# Altium project NIXIE_Display.PrjPcb
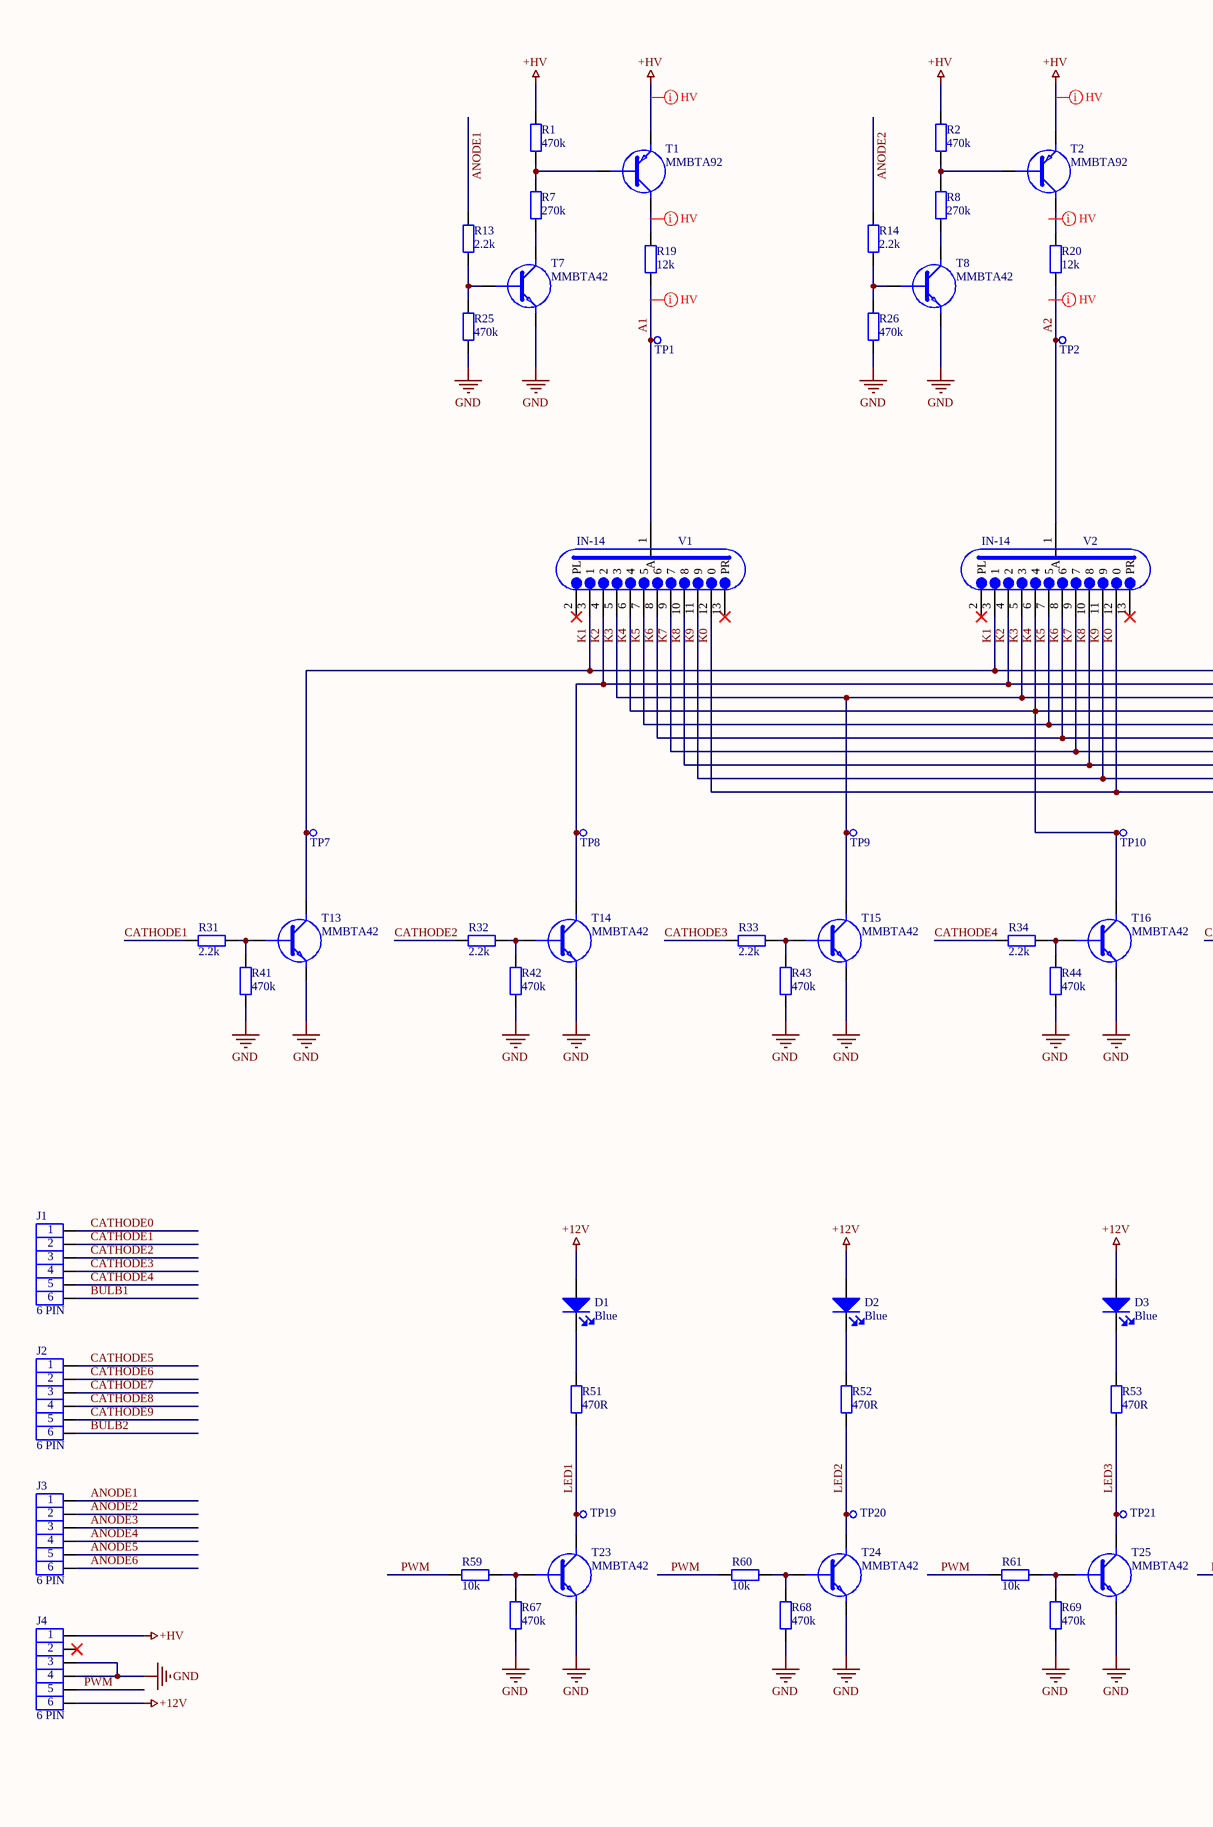
[diagram p0: NIXIE_Display.SchDoc, left]
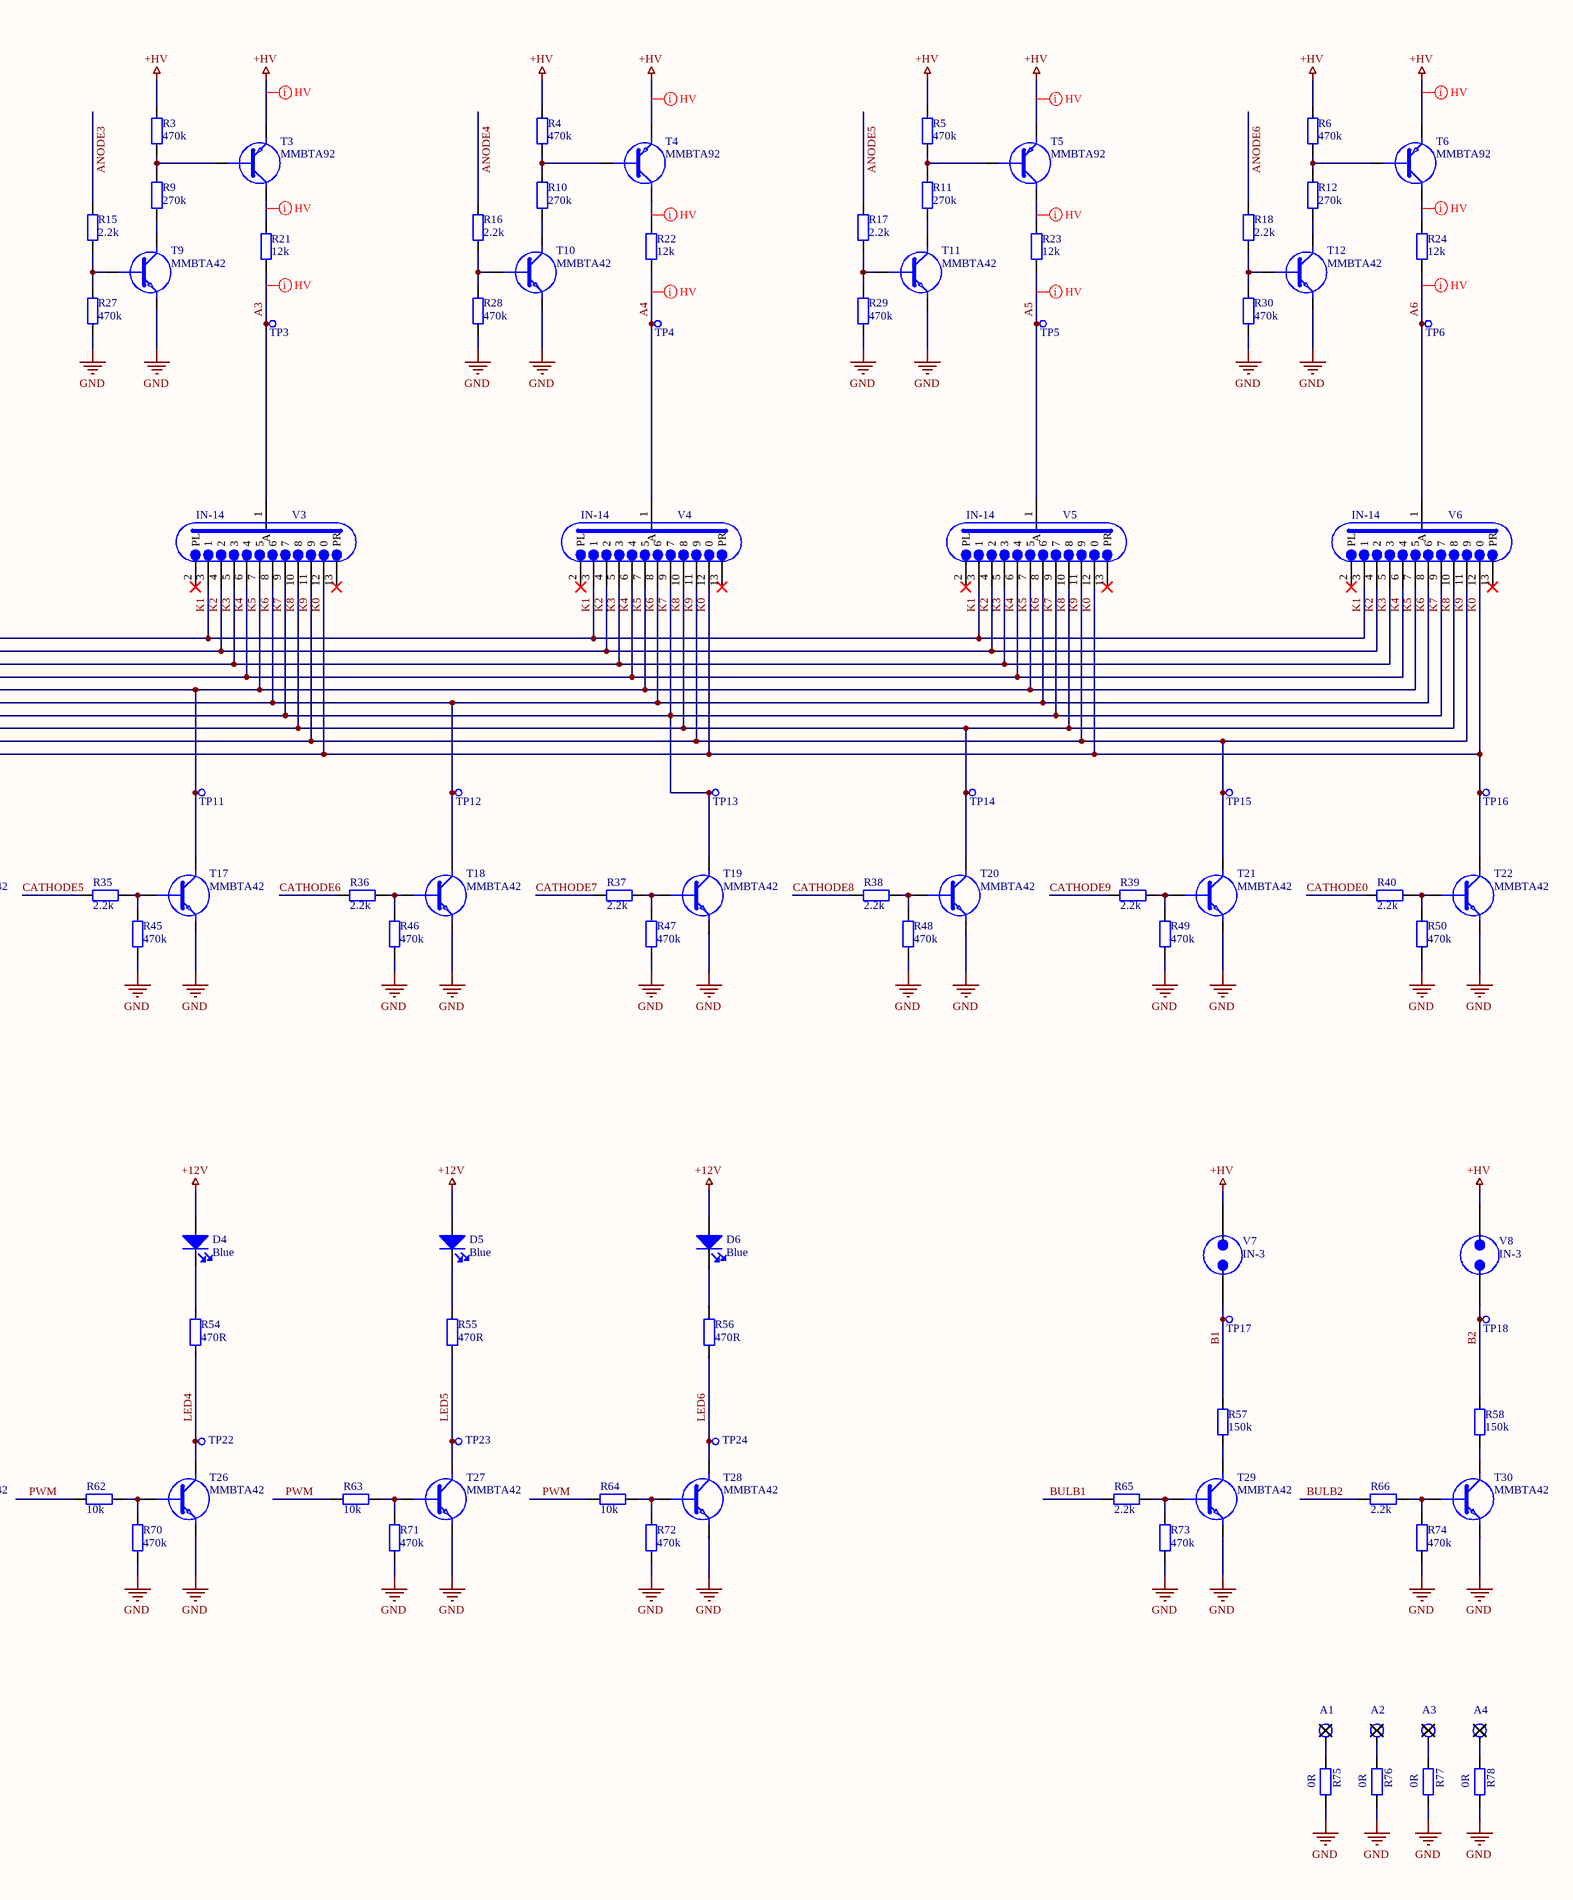
[diagram p1: NIXIE_Display.SchDoc, right]
1 sheet, 154 parts. Net scope: global (net labels, ports and power ports of the same name join across sheets).
Board file: NIXIE_Display.PcbDoc

## Sheet NIXIE_Display.SchDoc
size A2; SheetNumber: 1; SheetTotal: 1

### Parts
A1  3mm  [HOLE M3]  (value not drawn)
A2  3mm  [HOLE M3]  (value not drawn)
A3  3mm  [HOLE M3]  (value not drawn)
A4  3mm  [HOLE M3]  (value not drawn)
D1  Blue  [LED 0805]
D2  Blue  [LED 0805]
D3  Blue  [LED 0805]
D4  Blue  [LED 0805]
D5  Blue  [LED 0805]
D6  Blue  [LED 0805]
J1  6 PIN  [MECHANICAL PINHEADER 6P 2.54MM MALE]
J2  6 PIN  [MECHANICAL PINHEADER 6P 2.54MM MALE]
J3  6 PIN  [MECHANICAL PINHEADER 6P 2.54MM MALE]
J4  6 PIN  [MECHANICAL PINHEADER 6P 2.54MM MALE]
R1  470k  [RESISTOR 1206]
R2  470k  [RESISTOR 1206]
R3  470k  [RESISTOR 1206]
R4  470k  [RESISTOR 1206]
R5  470k  [RESISTOR 1206]
R6  470k  [RESISTOR 1206]
R7  270k  [RESISTOR 1206]
R8  270k  [RESISTOR 1206]
R9  270k  [RESISTOR 1206]
R10  270k  [RESISTOR 1206]
R11  270k  [RESISTOR 1206]
R12  270k  [RESISTOR 1206]
R13  2.2k  [RESISTOR 0603]
R14  2.2k  [RESISTOR 0603]
R15  2.2k  [RESISTOR 0603]
R16  2.2k  [RESISTOR 0603]
R17  2.2k  [RESISTOR 0603]
R18  2.2k  [RESISTOR 0603]
R19  12k  [RESISTOR 0603]
R20  12k  [RESISTOR 0603]
R21  12k  [RESISTOR 0603]
R22  12k  [RESISTOR 0603]
R23  12k  [RESISTOR 0603]
R24  12k  [RESISTOR 0603]
R25  470k  [RESISTOR 0603]
R26  470k  [RESISTOR 0603]
R27  470k  [RESISTOR 0603]
R28  470k  [RESISTOR 0603]
R29  470k  [RESISTOR 0603]
R30  470k  [RESISTOR 0603]
R31  2.2k  [RESISTOR 0603]
R32  2.2k  [RESISTOR 0603]
R33  2.2k  [RESISTOR 0603]
R34  2.2k  [RESISTOR 0603]
R35  2.2k  [RESISTOR 0603]
R36  2.2k  [RESISTOR 0603]
R37  2.2k  [RESISTOR 0603]
R38  2.2k  [RESISTOR 0603]
R39  2.2k  [RESISTOR 0603]
R40  2.2k  [RESISTOR 0603]
R41  470k  [RESISTOR 0603]
R42  470k  [RESISTOR 0603]
R43  470k  [RESISTOR 0603]
R44  470k  [RESISTOR 0603]
R45  470k  [RESISTOR 0603]
R46  470k  [RESISTOR 0603]
R47  470k  [RESISTOR 0603]
R48  470k  [RESISTOR 0603]
R49  470k  [RESISTOR 0603]
R50  470k  [RESISTOR 0603]
R51  470R  [RESISTOR 0603]
R52  470R  [RESISTOR 0603]
R53  470R  [RESISTOR 0603]
R54  470R  [RESISTOR 0603]
R55  470R  [RESISTOR 0603]
R56  470R  [RESISTOR 0603]
R57  150k  [RESISTOR 0603]
R58  150k  [RESISTOR 0603]
R59  10k  [RESISTOR 0603]
R60  10k  [RESISTOR 0603]
R61  10k  [RESISTOR 0603]
R62  10k  [RESISTOR 0603]
R63  10k  [RESISTOR 0603]
R64  10k  [RESISTOR 0603]
R65  2.2k  [RESISTOR 0603]
R66  2.2k  [RESISTOR 0603]
R67  470k  [RESISTOR 0603]
R68  470k  [RESISTOR 0603]
R69  470k  [RESISTOR 0603]
R70  470k  [RESISTOR 0603]
R71  470k  [RESISTOR 0603]
R72  470k  [RESISTOR 0603]
R73  470k  [RESISTOR 0603]
R74  470k  [RESISTOR 0603]
R75  0R  [RESISTOR 0603]
R76  0R  [RESISTOR 0603]
R77  0R  [RESISTOR 0603]
R78  0R  [RESISTOR 0603]
T1  MMBTA92  [SOT23-3]
T2  MMBTA92  [SOT23-3]
T3  MMBTA92  [SOT23-3]
T4  MMBTA92  [SOT23-3]
T5  MMBTA92  [SOT23-3]
T6  MMBTA92  [SOT23-3]
T7  MMBTA42  [SOT23-3]
T8  MMBTA42  [SOT23-3]
T9  MMBTA42  [SOT23-3]
T10  MMBTA42  [SOT23-3]
T11  MMBTA42  [SOT23-3]
T12  MMBTA42  [SOT23-3]
T13  MMBTA42  [SOT23-3]
T14  MMBTA42  [SOT23-3]
T15  MMBTA42  [SOT23-3]
T16  MMBTA42  [SOT23-3]
T17  MMBTA42  [SOT23-3]
T18  MMBTA42  [SOT23-3]
T19  MMBTA42  [SOT23-3]
T20  MMBTA42  [SOT23-3]
T21  MMBTA42  [SOT23-3]
T22  MMBTA42  [SOT23-3]
T23  MMBTA42  [SOT23-3]
T24  MMBTA42  [SOT23-3]
T25  MMBTA42  [SOT23-3]
T26  MMBTA42  [SOT23-3]
T27  MMBTA42  [SOT23-3]
T28  MMBTA42  [SOT23-3]
T29  MMBTA42  [SOT23-3]
T30  MMBTA42  [SOT23-3]
TP1  1mm  [TEST POINT 1MM]  (value not drawn)
TP2  1mm  [TEST POINT 1MM]  (value not drawn)
TP3  1mm  [TEST POINT 1MM]  (value not drawn)
TP4  1mm  [TEST POINT 1MM]  (value not drawn)
TP5  1mm  [TEST POINT 1MM]  (value not drawn)
TP6  1mm  [TEST POINT 1MM]  (value not drawn)
TP7  1mm  [TEST POINT 1MM]  (value not drawn)
TP8  1mm  [TEST POINT 1MM]  (value not drawn)
TP9  1mm  [TEST POINT 1MM]  (value not drawn)
TP10  1mm  [TEST POINT 1MM]  (value not drawn)
TP11  1mm  [TEST POINT 1MM]  (value not drawn)
TP12  1mm  [TEST POINT 1MM]  (value not drawn)
TP13  1mm  [TEST POINT 1MM]  (value not drawn)
TP14  1mm  [TEST POINT 1MM]  (value not drawn)
TP15  1mm  [TEST POINT 1MM]  (value not drawn)
TP16  1mm  [TEST POINT 1MM]  (value not drawn)
TP17  1mm  [TEST POINT 1MM]  (value not drawn)
TP18  1mm  [TEST POINT 1MM]  (value not drawn)
TP19  1mm  [TEST POINT 1MM]  (value not drawn)
TP20  1mm  [TEST POINT 1MM]  (value not drawn)
TP21  1mm  [TEST POINT 1MM]  (value not drawn)
TP22  1mm  [TEST POINT 1MM]  (value not drawn)
TP23  1mm  [TEST POINT 1MM]  (value not drawn)
TP24  1mm  [TEST POINT 1MM]  (value not drawn)
V1  IN-14  [IN-14]
V2  IN-14  [IN-14]
V3  IN-14  [IN-14]
V4  IN-14  [IN-14]
V5  IN-14  [IN-14]
V6  IN-14  [IN-14]
V7  IN-3  [IN-3]
V8  IN-3  [IN-3]

### Nets
+12V: D1.1 D2.1 D3.1 D4.1 D5.1 D6.1 J4.6
+HV: J4.1 R1.2 R2.2 R3.2 R4.2 R5.2 R6.2 T1.2(E) T2.2(E) T3.2(E) T4.2(E) T5.2(E) T6.2(E) V7.2 V8.2
GND: J4.3 J4.4 R25.1 R26.1 R27.1 R28.1 R29.1 R30.1 R41.1 R42.1 R43.1 R44.1 R45.1 R46.1 R47.1 R48.1 R49.1 R50.1 R67.1 R68.1 R69.1 R70.1 R71.1 R72.1 R73.1 R74.1 R75.1 R76.1 R77.1 R78.1 T7.2(E) T8.2(E) T9.2(E) T10.2(E) T11.2(E) T12.2(E) T13.2(E) T14.2(E) T15.2(E) T16.2(E) T17.2(E) T18.2(E) T19.2(E) T20.2(E) T21.2(E) T22.2(E) T23.2(E) T24.2(E) T25.2(E) T26.2(E) T27.2(E) T28.2(E) T29.2(E) T30.2(E)
A1: R19.1 TP1.1 V1.1(A)
A2: R20.1 TP2.1 V2.1(A)
A3: R21.1 TP3.1 V3.1(A)
A4: R22.1 TP4.1 V4.1(A)
A5: R23.1 TP5.1 V5.1(A)
A6: R24.1 TP6.1 V6.1(A)
ANODE1: J3.1 R13.1
ANODE2: J3.2 R14.1
ANODE3: J3.3 R15.1
ANODE4: J3.4 R16.1
ANODE5: J3.5 R17.1
ANODE6: J3.6 R18.1
B1: R57.2 TP17.1 V7.1
B2: R58.2 TP18.1 V8.1
BULB1: J1.6 R65.1
BULB2: J2.6 R66.1
CATHODE0: J1.1 R40.1
CATHODE1: J1.2 R31.1
CATHODE2: J1.3 R32.1
CATHODE3: J1.4 R33.1
CATHODE4: J1.5 R34.1
CATHODE5: J2.1 R35.1
CATHODE6: J2.2 R36.1
CATHODE7: J2.3 R37.1
CATHODE8: J2.4 R38.1
CATHODE9: J2.5 R39.1
K0: T22.3(C) TP16.1 V1.12(0) V2.12(0) V3.12(0) V4.12(0) V5.12(0) V6.12(0)
K1: T13.3(C) TP7.1 V1.3(1) V2.3(1) V3.3(1) V4.3(1) V5.3(1) V6.3(1)
K2: T14.3(C) TP8.1 V1.4(2) V2.4(2) V3.4(2) V4.4(2) V5.4(2) V6.4(2)
K3: T15.3(C) TP9.1 V1.5(3) V2.5(3) V3.5(3) V4.5(3) V5.5(3) V6.5(3)
K4: T16.3(C) TP10.1 V1.6(4) V2.6(4) V3.6(4) V4.6(4) V5.6(4) V6.6(4)
K5: T17.3(C) TP11.1 V1.7(5) V2.7(5) V3.7(5) V4.7(5) V5.7(5) V6.7(5)
K6: T18.3(C) TP12.1 V1.8(6) V2.8(6) V3.8(6) V4.8(6) V5.8(6) V6.8(6)
K7: T19.3(C) TP13.1 V1.9(7) V2.9(7) V3.9(7) V4.9(7) V5.9(7) V6.9(7)
K8: T20.3(C) TP14.1 V1.10(8) V2.10(8) V3.10(8) V4.10(8) V5.10(8) V6.10(8)
K9: T21.3(C) TP15.1 V1.11(9) V2.11(9) V3.11(9) V4.11(9) V5.11(9) V6.11(9)
LED1: R51.1 T23.3(C) TP19.1
LED2: R52.1 T24.3(C) TP20.1
LED3: R53.1 T25.3(C) TP21.1
LED4: R54.1 T26.3(C) TP22.1
LED5: R55.1 T27.3(C) TP23.1
LED6: R56.1 T28.3(C) TP24.1
PWM: J4.5 R59.1 R60.1 R61.1 R62.1 R63.1 R64.1
NetA1_1: A1.1 R75.2
NetA2_1: A2.1 R76.2
NetA3_1: A3.1 R77.2
NetA4_1: A4.1 R78.2
NetD1_2: D1.2 R51.2
NetD2_2: D2.2 R52.2
NetD3_2: D3.2 R53.2
NetD4_2: D4.2 R54.2
NetD5_2: D5.2 R55.2
NetD6_2: D6.2 R56.2
NetR1_1: R1.1 R7.2 T1.1(B)
NetR2_1: R2.1 R8.2 T2.1(B)
NetR3_1: R3.1 R9.2 T3.1(B)
NetR4_1: R4.1 R10.2 T4.1(B)
NetR5_1: R5.1 R11.2 T5.1(B)
NetR6_1: R6.1 R12.2 T6.1(B)
NetR7_1: R7.1 T7.3(C)
NetR8_1: R8.1 T8.3(C)
NetR9_1: R9.1 T9.3(C)
NetR10_1: R10.1 T10.3(C)
NetR11_1: R11.1 T11.3(C)
NetR12_1: R12.1 T12.3(C)
NetR13_2: R13.2 R25.2 T7.1(B)
NetR14_2: R14.2 R26.2 T8.1(B)
NetR15_2: R15.2 R27.2 T9.1(B)
NetR16_2: R16.2 R28.2 T10.1(B)
NetR17_2: R17.2 R29.2 T11.1(B)
NetR18_2: R18.2 R30.2 T12.1(B)
NetR19_2: R19.2 T1.3(C)
NetR20_2: R20.2 T2.3(C)
NetR21_2: R21.2 T3.3(C)
NetR22_2: R22.2 T4.3(C)
NetR23_2: R23.2 T5.3(C)
NetR24_2: R24.2 T6.3(C)
NetR31_2: R31.2 R41.2 T13.1(B)
NetR32_2: R32.2 R42.2 T14.1(B)
NetR33_2: R33.2 R43.2 T15.1(B)
NetR34_2: R34.2 R44.2 T16.1(B)
NetR35_2: R35.2 R45.2 T17.1(B)
NetR36_2: R36.2 R46.2 T18.1(B)
NetR37_2: R37.2 R47.2 T19.1(B)
NetR38_2: R38.2 R48.2 T20.1(B)
NetR39_2: R39.2 R49.2 T21.1(B)
NetR40_2: R40.2 R50.2 T22.1(B)
NetR57_1: R57.1 T29.3(C)
NetR58_1: R58.1 T30.3(C)
NetR59_2: R59.2 R67.2 T23.1(B)
NetR60_2: R60.2 R68.2 T24.1(B)
NetR61_2: R61.2 R69.2 T25.1(B)
NetR62_2: R62.2 R70.2 T26.1(B)
NetR63_2: R63.2 R71.2 T27.1(B)
NetR64_2: R64.2 R72.2 T28.1(B)
NetR65_2: R65.2 R73.2 T29.1(B)
NetR66_2: R66.2 R74.2 T30.1(B)

Not connected (* = marked no-connect by the designer): J4 2*; V1 2(PL)* 13(PR)*; V2 2(PL)* 13(PR)*; V3 2(PL)* 13(PR)*; V4 2(PL)* 13(PR)*; V5 2(PL)* 13(PR)*; V6 2(PL)* 13(PR)*

### Layout directives
net class HV: (no net found under the mark), +HV, A1, A3, A4, A5, A6, NetR19_2, NetR21_2, NetR22_2, NetR23_2, NetR24_2

### Library data of the parts
A1-A4 = Mechanical M3 Hole: ComponentLink1Description: Datasheet; ComponentLink1URL: -; Manufacturer: -; Manufacturer Part Number: -; Footprint: -; Price 10pcs [$]: -; Supplier: -
D1-D6 = Diode LED Blue 0805 SMD 20mA: Standard LEDs - SMD WL-SMCW SMDMono TpVw Waterclr 0805 Blue; Manufacturer: Wurth Elektronik; Manufacturer Part Number: 150080BS75000; Price 10pcs [$]: 0.192; Supplier: Mouser; ComponentLink1Description: Datasheet; ComponentLink1URL: https://www.mouser.pl/datasheet/2/445/150080GS75000-3084983.pdf
J1-J4 = Mechanical Pinheader Male 6pin P=2.54mm THT: Headers & Wire Housings 2.54MM CGRIDIII HDR 6P VERT SR SEL AU; Manufacturer: Molex; Manufacturer Part Number: 90120-0766; ComponentLink1Description: Datasheet; ComponentLink1URL: https://www.mouser.pl/datasheet/2/276/3/0901200765_PCB_HEADERS-2849265.pdf; Price 10pcs [$]: 1.65; Supplier: Mouser
R1-R6 = Resistor 470k 1% 1/4W 1206: Thin Film Resistors - SMD 1/4W470 kohm 1% 50ppm; Manufacturer: Yageo; Manufacturer Part Number: RT1206FRE07470KL; ComponentLink1Description: Datasheet; ComponentLink1URL: https://www.mouser.pl/datasheet/2/447/PYu_RT_1_to_0_01_RoHS_L_12-3003070.pdf; Footprint: Resistor 1206; Price 10pcs [$]: 0.125; Supplier: Mouser
R7-R12 = Resistor 270k 1% 1/4W 1206: Thin Film Resistors - SMD 1/4W 270 kohm 1% 50ppm; Manufacturer: Yageo; Manufacturer Part Number: RT1206FRE07270KL; ComponentLink1Description: Datasheet; ComponentLink1URL: https://www.mouser.pl/datasheet/2/447/PYu_RT_1_to_0_01_RoHS_L_12-3003070.pdf; Footprint: Resistor 1206; Price 10pcs [$]: 0.125; Supplier: Mouser
R13-R18 R31-R40 R65 R66 = Resistor 2.2k 1% 1/10W 0603: Thin Film Resistors - SMD 1/10W 2.2K ohm 1% 50ppm; Manufacturer: Yageo; Manufacturer Part Number: RT0603FRE072K2L; ComponentLink1Description: Datasheet; ComponentLink1URL: https://www.mouser.pl/datasheet/2/447/PYu_RT_1_to_0_01_RoHS_L_12-3003070.pdf; Footprint: Resistor 0603; Price 10pcs [$]: 0.057; Supplier: Mouser
R19-R24 = Resistor 12k 1% 1/10W 0603: Thin Film Resistors - SMD 1/10W 12K ohm 1% 50ppm; Manufacturer: Yageo; Manufacturer Part Number: RT0603FRE1312KL; ComponentLink1Description: Datasheet; ComponentLink1URL: https://www.mouser.pl/datasheet/2/447/PYu_RT_1_to_0_01_RoHS_L_12-3003070.pdf; Footprint: Resistor 0603; Price 10pcs [$]: 0.057; Supplier: Mouser
R25-R30 R41-R50 R67-R74 = Resistor 470k 1% 1/10W 0603: Thin Film Resistors - SMD 1/10W 470K ohm 1% 50ppm; Manufacturer: Yageo; Manufacturer Part Number: RT0603FRE13470KL; ComponentLink1Description: Datasheet; ComponentLink1URL: https://www.mouser.pl/datasheet/2/447/PYu_RT_1_to_0_01_RoHS_L_12-3003070.pdf; Footprint: Resistor 0603; Price 10pcs [$]: 0.07; Supplier: Mouser
R51-R56 = Resistor 470R 1% 1/10W 0603: Thin Film Resistors - SMD 1/10W 470R ohm 1% 50ppm; Manufacturer: Yageo; Manufacturer Part Number: RT0603FRE07470RL; ComponentLink1Description: Datasheet; ComponentLink1URL: https://www.mouser.pl/datasheet/2/447/PYu_RT_1_to_0_01_RoHS_L_12-3003070.pdf; Footprint: Resistor 0603; Price 10pcs [$]: 0.057; Supplier: Mouser
R57 R58 = Resistor 150k 1% 1/10W 0603: Thin Film Resistors - SMD 1/10W 150K ohm 1% 50ppm; Manufacturer: Yageo; Manufacturer Part Number: RT0603FRE13150KL; ComponentLink1Description: Datasheet; ComponentLink1URL: https://www.mouser.pl/datasheet/2/447/PYu_RT_1_to_0_01_RoHS_L_12-3003070.pdf; Footprint: Resistor 0603; Price 10pcs [$]: 0.057; Supplier: Mouser
R59-R64 = Resistor 10k 1% 1/10W 0603: Thin Film Resistors - SMD 1/10W 10K ohm 1% 50ppm; Manufacturer: Yageo; Manufacturer Part Number: RT0603FRE1310KL; ComponentLink1Description: Datasheet; ComponentLink1URL: https://www.mouser.pl/datasheet/2/447/PYu_RT_1_to_0_01_RoHS_L_12-3003070.pdf; Footprint: Resistor 0603; Price 10pcs [$]: 0.057; Supplier: Mouser
R75-R78 = Resistor 0R 1% 1/10W 0603: Thick Film Resistors - SMD 0 Ohms 100 mW 0603 5%; Manufacturer: Yageo; Manufacturer Part Number: RC0603JR-070RL; ComponentLink1Description: Datasheet; ComponentLink1URL: https://www.mouser.pl/datasheet/2/447/PYu_RC_Group_51_RoHS_L_11-1984063.pdf; Footprint: Resistor 0603; Price 10pcs [$]: 0.02; Supplier: Mouser
T1-T6 = Transistor PNP 500mA 300V MMBTA92: Bipolar Transistors - BJT BJT, SOT-23, 300V, 500mA, PNP; Manufacturer Part Number: MMBTA42; Manufacturer: Diotec Semiconductor; Supplier: Mouser; Price 10pcs [$]: 0.285; ComponentLink1Description: Datasheet; ComponentLink1URL: https://www.mouser.pl/datasheet/2/849/mmbta92-2578541.pdf
T7-T30 = Transistor NPN 500mA 300V MMBTA42: Bipolar Transistors - BJT BJT, SOT-23, 300V, 500mA, NPN; Manufacturer: Diotec Semiconductor; Manufacturer Part Number: MMBTA42; Supplier: Mouser; Price 10pcs [$]: 0.285; ComponentLink1Description: Datasheet; ComponentLink1URL: https://www.mouser.pl/datasheet/2/849/mmbta42-2577486.pdf
TP1-TP24 = Mechanical Test Point 1mm: Tesp Point 1mm; ComponentLink1Description: Datasheet; ComponentLink1URL: -; Manufacturer: -; Manufacturer Part Number: -; Footprint: -; Price 10pcs [$]: -; Supplier: -
V1-V6 = Tube Nixie IN-14: Nixie IN-14
V7 V8 = Tube Neon IN-3: Nixie IN-8-2

## Assembly variants
IN14: not fitted V2 V4 V6 V8 V10 V12
IN12: not fitted V1 V3 V5 V7 V9 V11